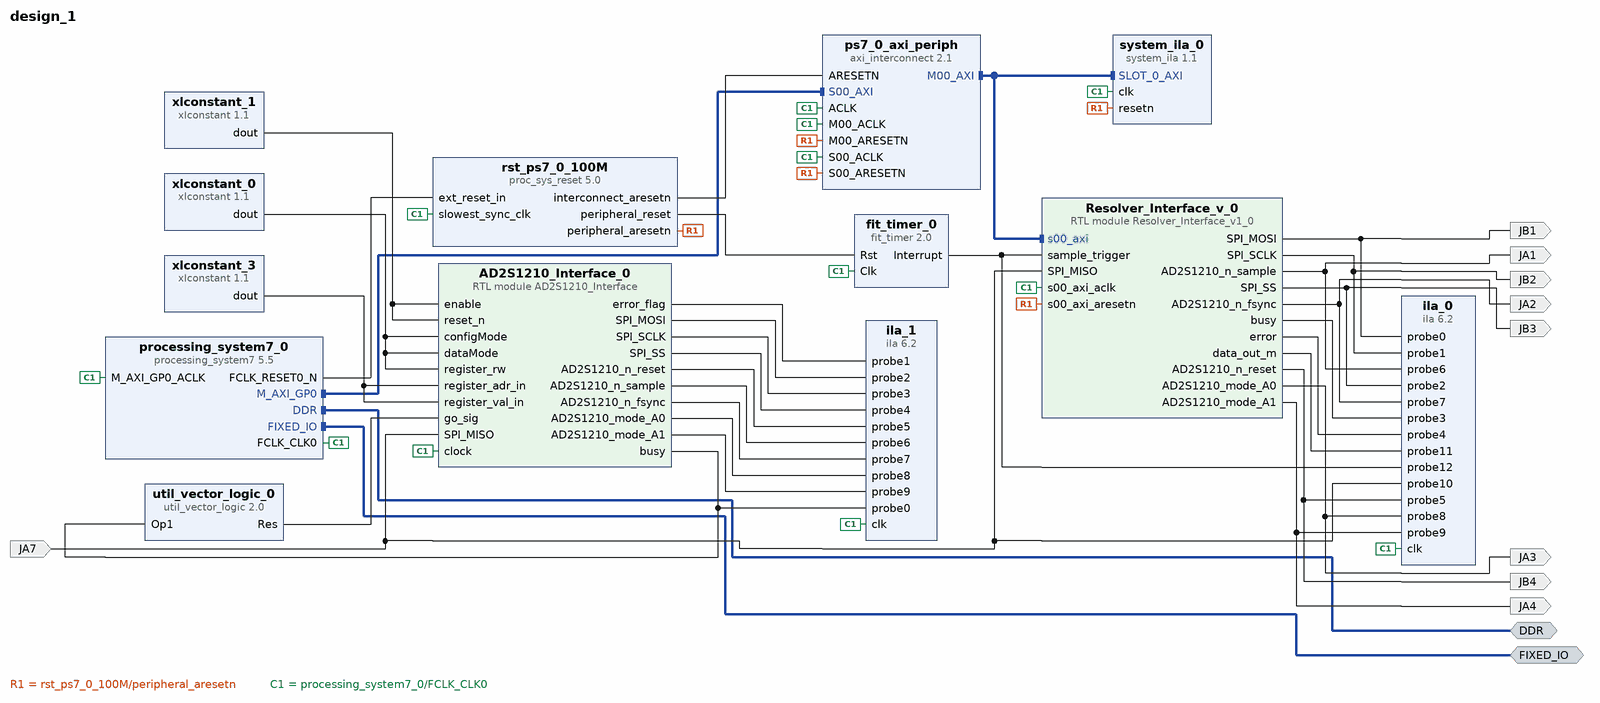
[diagram p0: block diagram of the top level]
# Vivado block design design_1, xc7z020clg484-1, Vivado 2020.1
create_bd_design design_1

create_bd_intf_port -mode Master -vlnv xilinx.com:interface:ddrx_rtl:1.0 DDR
create_bd_intf_port -mode Master -vlnv xilinx.com:display_processing_system7:fixedio_rtl:1.0 FIXED_IO
create_bd_port -dir O JA1
create_bd_port -dir O JA2
create_bd_port -dir O JA3
create_bd_port -dir O JA4
create_bd_port -dir O JB1
create_bd_port -dir O JB2
create_bd_port -dir O JB3
create_bd_port -dir O JB4
create_bd_port -dir I JA7

create_bd_cell -type ip -vlnv xilinx.com:ip:processing_system7:5.5 processing_system7_0
set_property -dict [list \
  CONFIG.PCW_APU_PERIPHERAL_FREQMHZ 666.666667 \
  CONFIG.PCW_ENET0_ENET0_IO {MIO 16 .. 27} \
  CONFIG.PCW_ENET0_GRP_MDIO_ENABLE 1 \
  CONFIG.PCW_ENET0_GRP_MDIO_IO {MIO 52 .. 53} \
  CONFIG.PCW_ENET0_PERIPHERAL_ENABLE 1 \
  CONFIG.PCW_ENET0_RESET_ENABLE 0 \
  CONFIG.PCW_ENET_RESET_ENABLE 1 \
  CONFIG.PCW_ENET_RESET_SELECT {Share reset pin} \
  CONFIG.PCW_FPGA0_PERIPHERAL_FREQMHZ 100.000000 \
  CONFIG.PCW_FPGA1_PERIPHERAL_FREQMHZ 150.000000 \
  CONFIG.PCW_GPIO_MIO_GPIO_ENABLE 1 \
  CONFIG.PCW_GPIO_MIO_GPIO_IO MIO \
  CONFIG.PCW_I2C_RESET_ENABLE 1 \
  CONFIG.PCW_PRESET_BANK1_VOLTAGE {LVCMOS 1.8V} \
  CONFIG.PCW_QSPI_GRP_SINGLE_SS_ENABLE 1 \
  CONFIG.PCW_QSPI_GRP_SINGLE_SS_IO {MIO 1 .. 6} \
  CONFIG.PCW_QSPI_PERIPHERAL_ENABLE 1 \
  CONFIG.PCW_QSPI_QSPI_IO {MIO 1 .. 6} \
  CONFIG.PCW_SD0_GRP_CD_ENABLE 1 \
  CONFIG.PCW_SD0_GRP_CD_IO {MIO 47} \
  CONFIG.PCW_SD0_GRP_WP_ENABLE 1 \
  CONFIG.PCW_SD0_GRP_WP_IO {MIO 46} \
  CONFIG.PCW_SD0_PERIPHERAL_ENABLE 1 \
  CONFIG.PCW_SD0_SD0_IO {MIO 40 .. 45} \
  CONFIG.PCW_SDIO_PERIPHERAL_FREQMHZ 50 \
  CONFIG.PCW_SINGLE_QSPI_DATA_MODE x4 \
  CONFIG.PCW_TTC0_PERIPHERAL_ENABLE 1 \
  CONFIG.PCW_TTC0_TTC0_IO EMIO \
  CONFIG.PCW_UART1_PERIPHERAL_ENABLE 1 \
  CONFIG.PCW_UART1_UART1_IO {MIO 48 .. 49} \
  CONFIG.PCW_UART_PERIPHERAL_FREQMHZ 50 \
  CONFIG.PCW_UIPARAM_DDR_FREQ_MHZ 533.333313 \
  CONFIG.PCW_UIPARAM_DDR_PARTNO {MT41J128M16 HA-15E} \
  CONFIG.PCW_USB0_PERIPHERAL_ENABLE 1 \
  CONFIG.PCW_USB0_RESET_ENABLE 0 \
  CONFIG.PCW_USB0_USB0_IO {MIO 28 .. 39} \
  CONFIG.PCW_USB_RESET_ENABLE 1 \
  CONFIG.PCW_USB_RESET_SELECT {Share reset pin} \
  CONFIG.preset ZedBoard \
] [get_bd_cells processing_system7_0]
# 223 more settings of processing_system7_0 are not shown: defaults, MIO pin electricals, DDR timing, and values the tool derives
create_bd_cell -type ip -vlnv xilinx.com:ip:axi_interconnect:2.1 ps7_0_axi_periph
set_property -dict {CONFIG.NUM_MI 1} [get_bd_cells ps7_0_axi_periph]
create_bd_cell -type ip -vlnv xilinx.com:ip:proc_sys_reset:5.0 rst_ps7_0_100M
create_bd_cell -type ip -vlnv xilinx.com:ip:xlconstant:1.1 xlconstant_0
set_property -dict {CONFIG.CONST_VAL 0} [get_bd_cells xlconstant_0]
create_bd_cell -type ip -vlnv xilinx.com:ip:xlconstant:1.1 xlconstant_1
set_property -dict {CONFIG.CONST_VAL 1} [get_bd_cells xlconstant_1]
create_bd_cell -type ip -vlnv xilinx.com:ip:util_vector_logic:2.0 util_vector_logic_0
set_property -dict {CONFIG.C_OPERATION not CONFIG.C_SIZE 1} [get_bd_cells util_vector_logic_0]
create_bd_cell -type ip -vlnv xilinx.com:ip:ila:6.2 ila_0
set_property -dict [list \
  CONFIG.C_DATA_DEPTH 2048 \
  CONFIG.C_ENABLE_ILA_AXI_MON false \
  CONFIG.C_MONITOR_TYPE Native \
  CONFIG.C_NUM_OF_PROBES 13 \
  CONFIG.C_PROBE11_WIDTH 16 \
] [get_bd_cells ila_0]
create_bd_cell -type ip -vlnv xilinx.com:ip:system_ila:1.1 system_ila_0
create_bd_cell -type ip -vlnv xilinx.com:ip:ila:6.2 ila_1
set_property -dict [list \
  CONFIG.C_DATA_DEPTH 2048 \
  CONFIG.C_ENABLE_ILA_AXI_MON false \
  CONFIG.C_MONITOR_TYPE Native \
  CONFIG.C_NUM_OF_PROBES 10 \
] [get_bd_cells ila_1]
create_bd_cell -type ip -vlnv xilinx.com:ip:xlconstant:1.1 xlconstant_3
set_property -dict {CONFIG.CONST_VAL 0 CONFIG.CONST_WIDTH 8} [get_bd_cells xlconstant_3]
create_bd_cell -type module -reference AD2S1210_Interface AD2S1210_Interface_0
create_bd_cell -type ip -vlnv xilinx.com:ip:fit_timer:2.0 fit_timer_0
set_property -dict {CONFIG.C_NO_CLOCKS 250} [get_bd_cells fit_timer_0]
create_bd_cell -type module -reference Resolver_Interface_v1_0 Resolver_Interface_v_0

# ---- connections ----

connect_bd_intf_net [get_bd_intf_pins ps7_0_axi_periph/M00_AXI] [get_bd_intf_pins Resolver_Interface_v_0/s00_axi]
connect_bd_intf_net [get_bd_intf_pins ps7_0_axi_periph/M00_AXI] [get_bd_intf_pins system_ila_0/SLOT_0_AXI]
connect_bd_intf_net [get_bd_intf_ports DDR] [get_bd_intf_pins processing_system7_0/DDR]
connect_bd_intf_net [get_bd_intf_pins processing_system7_0/M_AXI_GP0] [get_bd_intf_pins ps7_0_axi_periph/S00_AXI]
connect_bd_intf_net [get_bd_intf_ports FIXED_IO] [get_bd_intf_pins processing_system7_0/FIXED_IO]
connect_bd_net [get_bd_pins processing_system7_0/FCLK_RESET0_N] [get_bd_pins rst_ps7_0_100M/ext_reset_in]
connect_bd_net [get_bd_pins rst_ps7_0_100M/peripheral_aresetn] \
  [get_bd_pins ps7_0_axi_periph/S00_ARESETN] [get_bd_pins ps7_0_axi_periph/M00_ARESETN] [get_bd_pins system_ila_0/resetn] \
  [get_bd_pins Resolver_Interface_v_0/s00_axi_aresetn]
connect_bd_net [get_bd_pins xlconstant_1/dout] [get_bd_pins AD2S1210_Interface_0/reset_n] [get_bd_pins AD2S1210_Interface_0/enable]
connect_bd_net [get_bd_pins xlconstant_0/dout] \
  [get_bd_pins AD2S1210_Interface_0/dataMode] [get_bd_pins AD2S1210_Interface_0/configMode] \
  [get_bd_pins AD2S1210_Interface_0/register_rw]
connect_bd_net [get_bd_pins util_vector_logic_0/Res] [get_bd_pins AD2S1210_Interface_0/go_sig]
connect_bd_net [get_bd_pins AD2S1210_Interface_0/busy] [get_bd_pins util_vector_logic_0/Op1] [get_bd_pins ila_1/probe0]
connect_bd_net [get_bd_pins AD2S1210_Interface_0/error_flag] [get_bd_pins ila_1/probe1]
connect_bd_net [get_bd_pins Resolver_Interface_v_0/SPI_MOSI] [get_bd_ports JB1] [get_bd_pins ila_0/probe0]
connect_bd_net [get_bd_pins Resolver_Interface_v_0/SPI_SCLK] [get_bd_ports JB2] [get_bd_pins ila_0/probe1]
connect_bd_net [get_bd_pins Resolver_Interface_v_0/SPI_SS] [get_bd_ports JB3] [get_bd_pins ila_0/probe2]
connect_bd_net [get_bd_pins Resolver_Interface_v_0/busy] [get_bd_pins ila_0/probe3]
connect_bd_net [get_bd_pins rst_ps7_0_100M/interconnect_aresetn] [get_bd_pins ps7_0_axi_periph/ARESETN]
connect_bd_net [get_bd_pins AD2S1210_Interface_0/SPI_MOSI] [get_bd_pins ila_1/probe2]
connect_bd_net [get_bd_pins AD2S1210_Interface_0/SPI_SCLK] [get_bd_pins ila_1/probe3]
connect_bd_net [get_bd_pins Resolver_Interface_v_0/error] [get_bd_pins ila_0/probe4]
connect_bd_net [get_bd_pins Resolver_Interface_v_0/AD2S1210_n_reset] [get_bd_pins ila_0/probe5] [get_bd_ports JB4]
connect_bd_net [get_bd_pins Resolver_Interface_v_0/AD2S1210_n_sample] [get_bd_pins ila_0/probe6] [get_bd_ports JA1]
connect_bd_net [get_bd_pins Resolver_Interface_v_0/AD2S1210_n_fsync] [get_bd_pins ila_0/probe7] [get_bd_ports JA2]
connect_bd_net [get_bd_pins Resolver_Interface_v_0/AD2S1210_mode_A0] [get_bd_pins ila_0/probe8] [get_bd_ports JA3]
connect_bd_net [get_bd_pins Resolver_Interface_v_0/AD2S1210_mode_A1] [get_bd_pins ila_0/probe9] [get_bd_ports JA4]
connect_bd_net [get_bd_pins processing_system7_0/FCLK_CLK0] \
  [get_bd_pins ila_0/clk] [get_bd_pins processing_system7_0/M_AXI_GP0_ACLK] [get_bd_pins ps7_0_axi_periph/S00_ACLK] \
  [get_bd_pins ps7_0_axi_periph/ACLK] [get_bd_pins ps7_0_axi_periph/M00_ACLK] [get_bd_pins rst_ps7_0_100M/slowest_sync_clk] \
  [get_bd_pins system_ila_0/clk] [get_bd_pins ila_1/clk] [get_bd_pins AD2S1210_Interface_0/clock] \
  [get_bd_pins fit_timer_0/Clk] [get_bd_pins Resolver_Interface_v_0/s00_axi_aclk]
connect_bd_net [get_bd_pins AD2S1210_Interface_0/SPI_SS] [get_bd_pins ila_1/probe4]
connect_bd_net [get_bd_pins AD2S1210_Interface_0/AD2S1210_n_reset] [get_bd_pins ila_1/probe5]
connect_bd_net [get_bd_pins AD2S1210_Interface_0/AD2S1210_n_sample] [get_bd_pins ila_1/probe6]
connect_bd_net [get_bd_pins AD2S1210_Interface_0/AD2S1210_n_fsync] [get_bd_pins ila_1/probe7]
connect_bd_net [get_bd_pins AD2S1210_Interface_0/AD2S1210_mode_A0] [get_bd_pins ila_1/probe8]
connect_bd_net [get_bd_pins AD2S1210_Interface_0/AD2S1210_mode_A1] [get_bd_pins ila_1/probe9]
connect_bd_net -net JA5_1 [get_bd_ports JA7] \
  [get_bd_pins ila_0/probe10] [get_bd_pins AD2S1210_Interface_0/SPI_MISO] [get_bd_pins Resolver_Interface_v_0/SPI_MISO]
connect_bd_net [get_bd_pins xlconstant_3/dout] [get_bd_pins AD2S1210_Interface_0/register_adr_in] [get_bd_pins AD2S1210_Interface_0/register_val_in]
connect_bd_net [get_bd_pins rst_ps7_0_100M/peripheral_reset] [get_bd_pins fit_timer_0/Rst]
connect_bd_net [get_bd_pins fit_timer_0/Interrupt] [get_bd_pins ila_0/probe12] [get_bd_pins Resolver_Interface_v_0/sample_trigger]
connect_bd_net [get_bd_pins Resolver_Interface_v_0/data_out_m] [get_bd_pins ila_0/probe11]

# ---- address map ----
assign_bd_address -offset 0x43C00000 -range 64K -target_address_space [get_bd_addr_spaces processing_system7_0/Data] [get_bd_addr_segs Resolver_Interface_v_0/s00_axi/reg0]

validate_bd_design
save_bd_design
